# EasyEDA schematic SCH_LoRaMED_2024-02-08.json
TITLE: Sheet_1; REV: 1.0; Date: 2024-02-07; Sheet: 1/1; Drawn By: Ramesh Rajpal; Company: enveecto
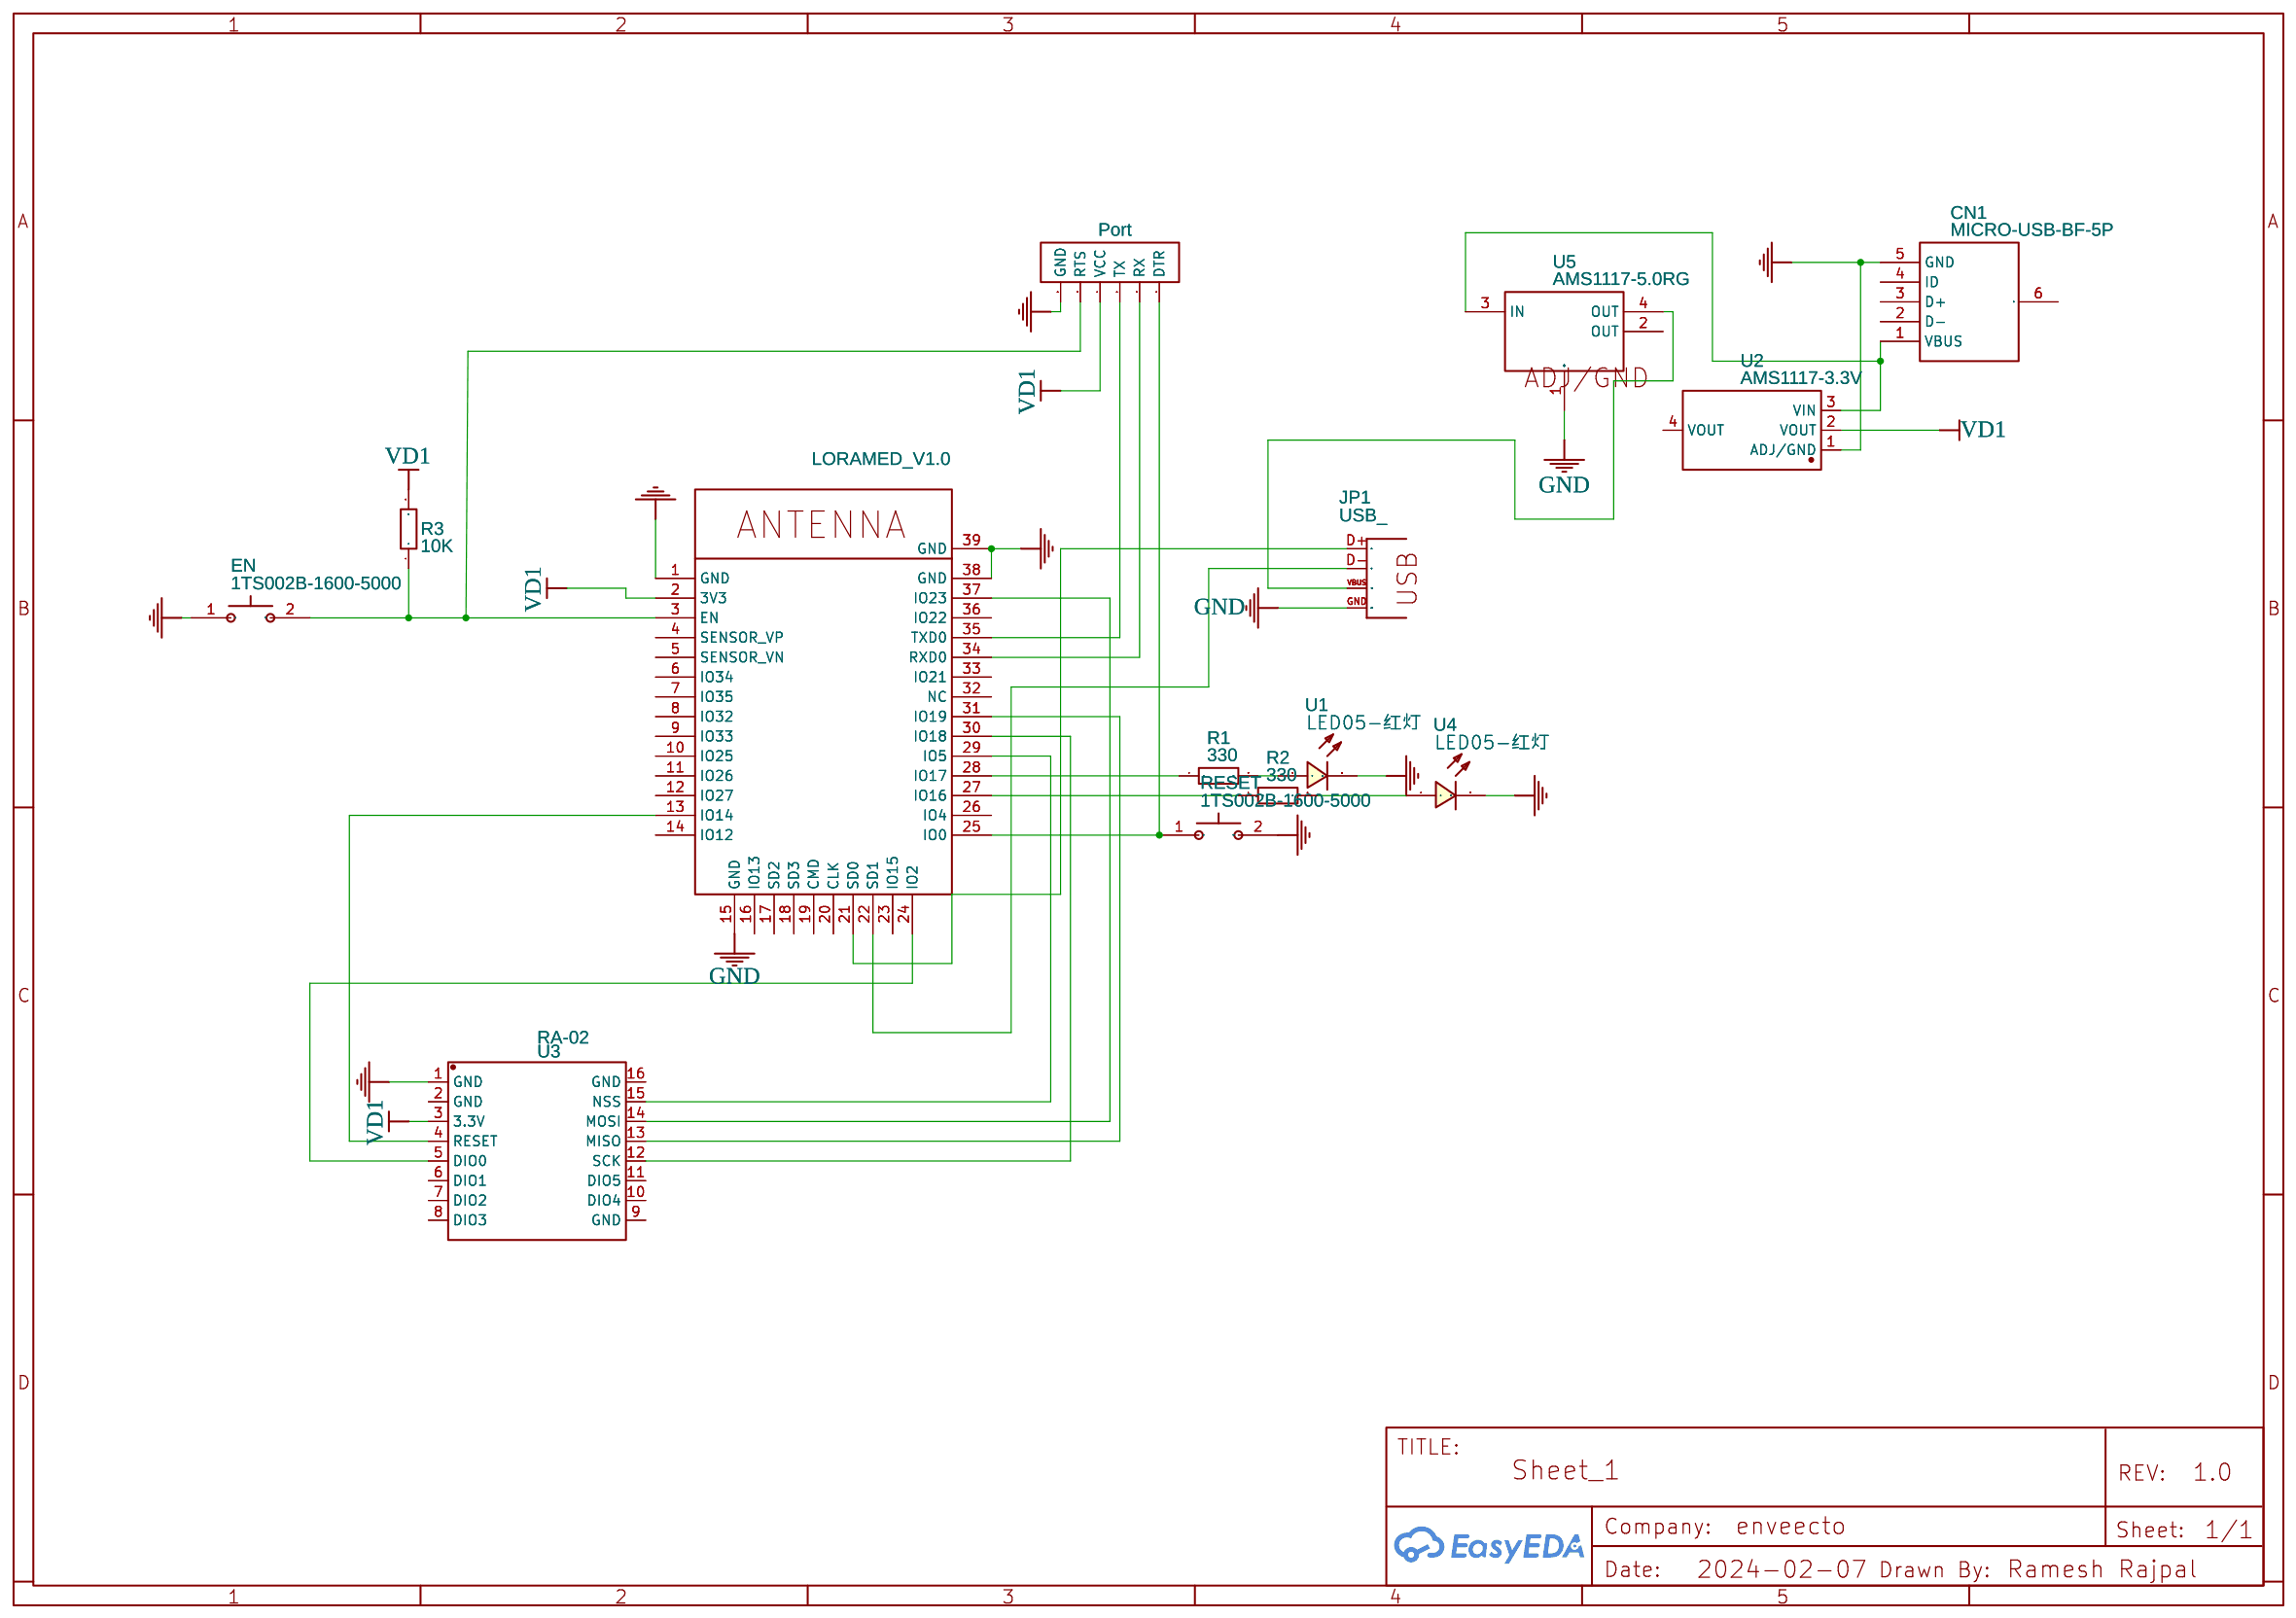
[diagram p0: schematic sheet]

## Parts
CN1  MICRO-USB-BF-5P  [MICRO-USB_FEMALE_A01SB]
EN  1TS002B-1600-5000  [KEY-TACT-SMD-6.0*3.5]
JP1  USB_  [USB-A-S-SILK-FEMALE]
LORAMED_V1  ESP32-WROOM-32D  [ESP32-WROOM-32D]  (section 0)
PORT1  Port  [HDR-6X1/2.54]
R1  330  [RES-SMD_L3.2-W1.6_PA1206]
R2  330  [RES-SMD_L3.2-W1.6_PA1206]
R3  10K  [RES-SMD_L3.2-W1.6_PA1206]
RESET  1TS002B-1600-5000  [KEY-TACT-SMD-6.0*3.5]
U1  LED05-红灯  [LED-TH_LED-3MM_RED]
U2  AMS1117-3.3V  [SOT-223-4_L6.5-W3.5-P2.30-LS7.0-BR]
U3  RA-02  [WIRELM-SMD_RA-02-BL]
U4  LED05-红灯  [LED-TH_LED-3MM_RED]
U5  AMS1117-5.0RG  [SOT-223-3_L6.4-W3.5-P2.30-LS7.0-BR]

## Library data of the parts
CN1 = MICRO-USB-BF-5P: Supplier Part: C46390; Supplier: LCSC; Manufacturer: ValuePro; Manufacturer Part: MICRO 5PFemaleBtype; JLCPCB Part Class: Extended Part
EN RESET = -: Supplier: LCSC; Supplier Part: C318837; Manufacturer: HYP; Contributor: LCSC
JP1 = USB_: USB Connectors; Contributor: SparkFun
LORAMED_V1 = -: Manufacturer: Espressif; Supplier Part: undefined; Supplier: Mouser; Contributor: crackingthecode
PORT1 = -: Supplier: LCSC; Manufacturer: BOOMELE; Manufacturer Part: Header-Male-2.54_1x6; Supplier Part: C37208
R1-R3 = PA1206DRF470R005L: Contributor: lcsc; Supplier: LCSC; Supplier Part: C723507; Manufacturer: YAGEO(国巨); JLCPCB Part Class: Extended Part
U1 U4 = LED05-红灯: Contributor: LCSC; Supplier: LCSC; Supplier Part: C9900009041; Manufacturer: null; JLCPCB Part Class: Extended Part
U2 = AMS1117-3.3V: Contributor: LCSC; Supplier: LCSC; Supplier Part: C2688239; Manufacturer: WPMtek(维攀); JLCPCB Part Class: Extended Part
U3 = RA-02: Contributor: LCSC; Supplier: LCSC; Supplier Part: C90039; Manufacturer: Ai-Thinker(安信可); Manufacturer Part: Ra-02; JLCPCB Part Class: Extended Part
U5 = AMS1117-5.0RG: Contributor: lcsc; Supplier: LCSC; Supplier Part: C2977151; Manufacturer: HGC(深圳汉芯); JLCPCB Part Class: Extended Part

## Nets
GND: CN1.5(GND) EN.1(A) JP1.GND LORAMED_V1.1(GND) LORAMED_V1.15(GND) LORAMED_V1.38(GND) LORAMED_V1.39(GND) PORT1.6(GND) RESET.2(B) U1.2 U2.1(ADJ/GND) U3.1(GND) U4.2 U5.1(ADJ/GND)
VD1: LORAMED_V1.2(3V3) PORT1.4(VCC) R3.2 U2.2(VOUT) U3.3(3.3V)
Net-(CN1-1): CN1.1(VBUS) U2.3(VIN) U5.3(IN)
Net-(EN-2): EN.2(B) LORAMED_V1.3(EN) PORT1.5(RTS) R3.1
Net-(JP1-D+): JP1.D+ LORAMED_V1.21(SD0)
Net-(JP1-D-): JP1.D- LORAMED_V1.22(SD1)
Net-(JP1-VBUS): JP1.VBUS U5.4(OUT)
Net-(LORAMED_V1.0-13): LORAMED_V1.13(IO14) U3.4(RESET)
Net-(LORAMED_V1.0-24): LORAMED_V1.24(IO2) U3.5(DIO0)
Net-(LORAMED_V1.0-25): LORAMED_V1.25(IO0) PORT1.1(DTR) RESET.1(A)
Net-(LORAMED_V1.0-27): LORAMED_V1.27(IO16) R2.1
Net-(LORAMED_V1.0-28): LORAMED_V1.28(IO17) R1.1
Net-(LORAMED_V1.0-29): LORAMED_V1.29(IO5) U3.15(NSS)
Net-(LORAMED_V1.0-30): LORAMED_V1.30(IO18) U3.12(SCK)
Net-(LORAMED_V1.0-31): LORAMED_V1.31(IO19) U3.13(MISO)
Net-(LORAMED_V1.0-34): LORAMED_V1.34(RXD0) PORT1.2(RX)
Net-(LORAMED_V1.0-35): LORAMED_V1.35(TXD0) PORT1.3(TX)
Net-(LORAMED_V1.0-37): LORAMED_V1.37(IO23) U3.14(MOSI)
Net-(R1-2): R1.2 U1.1
Net-(R2-2): R2.2 U4.1

Not connected (* = marked no-connect by the designer): CN1 2(D-) 3(D+) 4(ID) 6(EH); LORAMED_V1 4(SENSOR_VP) 5(SENSOR_VN) 6(IO34) 7(IO35) 8(IO32) 9(IO33) 10(IO25) 11(IO26) 12(IO27) 14(IO12) 16(IO13) 17(SD2) 18(SD3) 19(CMD) 20(CLK) 23(IO15) 26(IO4) 32(NC) 33(IO21) 36(IO22); U2 4(VOUT); U3 2(GND) 6(DIO1) 7(DIO2) 8(DIO3) 9(GND) 10(DIO4) 11(DIO5) 16(GND); U5 2(OUT)
